# EAGLE design fully-monty (EAGLE 9.1.1)
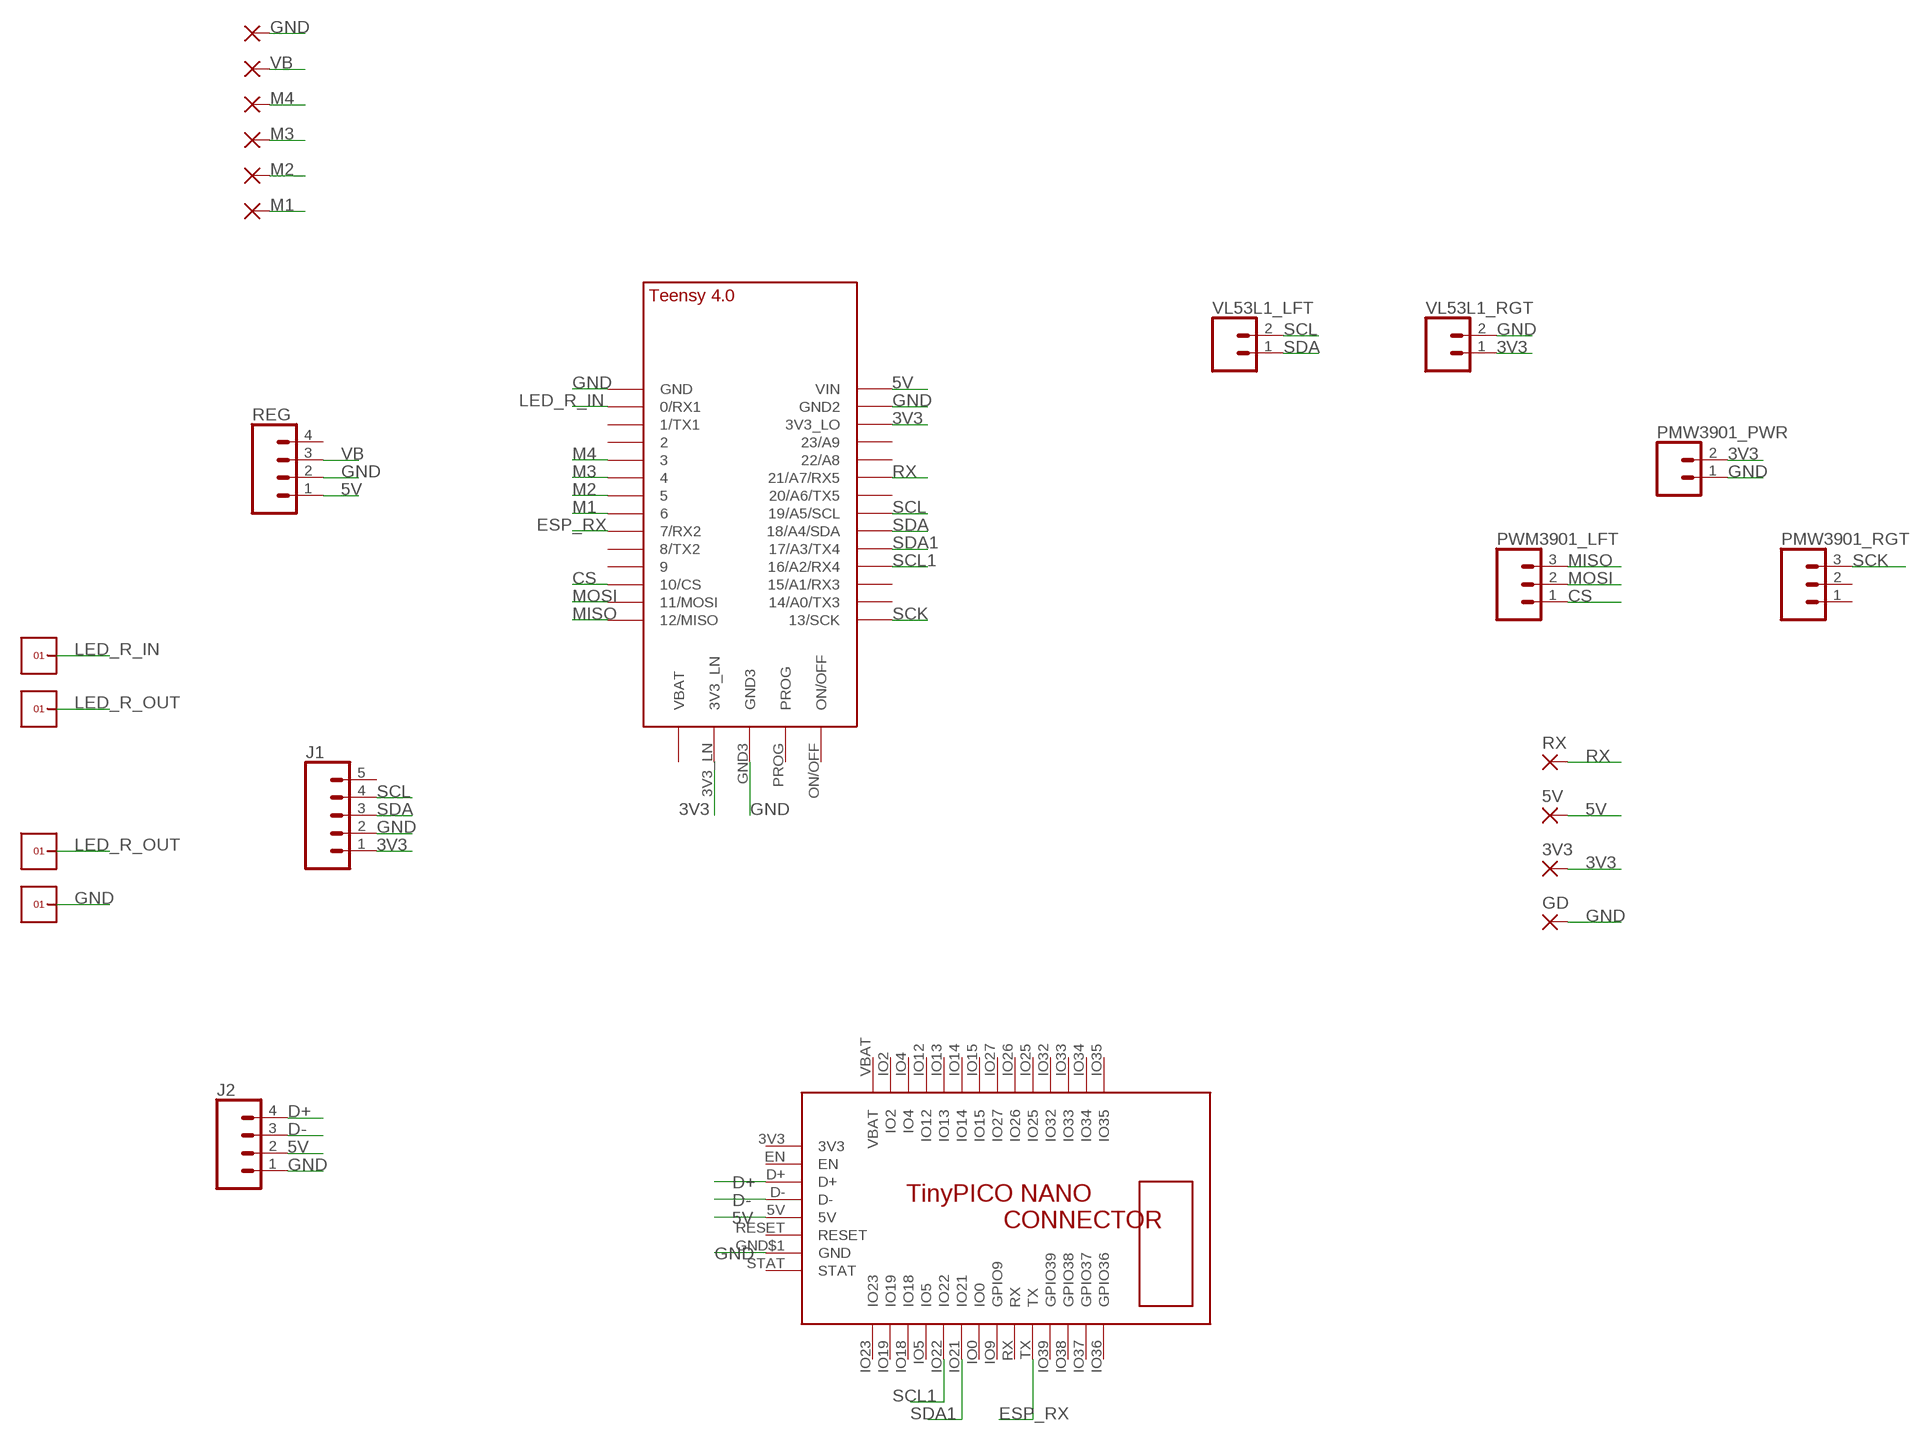
[diagram p0: schematic, sheet 1]

## Parts
3V3  SMD2  [SMD1,27-2,54]
5V  SMD2  [SMD1,27-2,54]
GD  SMD2  [SMD1,27-2,54]
GND  SMD2  [SMD1,27-2,54]
J1  CONN_05NO_SILK  [1X05_NO_SILK]
J2  CONN_041X04_NO_SILK  [1X04_NO_SILK]
M1  SMD2  [SMD1,27-2,54]
M2  SMD2  [SMD1,27-2,54]
M3  SMD2  [SMD1,27-2,54]
M4  SMD2  [SMD1,27-2,54]
PMW3901_PWR  CONN_021X02_NO_SILK  [1X02_NO_SILK]
PMW3901_RGT  CONN_031X03_NO_SILK  [1X03_NO_SILK]
PWM3901_LFT  CONN_031X03_NO_SILK  [1X03_NO_SILK]
REG  CONN_041X04_NO_SILK  [1X04_NO_SILK]
RX  SMD2  [SMD1,27-2,54]
U$1  TEENSY_4.0  [TEENSY_4.0]
U$2  TINYPICO-NANO-CONNECTOR  [TINYPICO-NANO-CONNECTOR]
U$3  1X1  [1X1]
U$4  1X1  [1X1]
U$6  1X1  [1X1]
U$7  1X1  [1X1]
VBAT  SMD2  [SMD1,27-2,54]
VL53L1_LFT  CONN_021X02_NO_SILK  [1X02_NO_SILK]
VL53L1_RGT  CONN_021X02_NO_SILK  [1X02_NO_SILK]

## Nets
3V3: 3V3.1(P) J1.1 PMW3901_PWR.2 U$1.3V3_LN U$1.3V3_LO VL53L1_RGT.1
5V: 5V.1(P) J2.2 REG.1 U$1.VIN U$2.5V
CS: PWM3901_LFT.1 U$1.10/CS
D+: J2.4 U$2.D+
D-: J2.3 U$2.D-
ESP_RX: U$1.7(7/RX2) U$2.TX
GND: GD.1(P) GND.1(P) J1.2 J2.1 PMW3901_PWR.1 REG.2 U$1.GND U$1.GND2 U$1.GND3 U$2.GND$1(GND) U$7.1 VL53L1_RGT.2
LED_R_IN: U$1.0/RX(0/RX1) U$3.1
LED_R_OUT: U$4.1 U$6.1
M1: M1.1(P) U$1.6
M2: M2.1(P) U$1.5
M3: M3.1(P) U$1.4/CANRX
M4: M4.1(P) U$1.3/CANTX
MISO: PWM3901_LFT.3 U$1.12/MISO
MOSI: PWM3901_LFT.2 U$1.11/MOSI
RX: RX.1(P) U$1.21/A7(21/A7/RX5)
SCK: PMW3901_RGT.3 U$1.13/SCK
SCL: J1.4 U$1.19/A5/SCL VL53L1_LFT.2
SCL1: U$1.16/A2(16/A2/RX4) U$2.IO22
SDA: J1.3 U$1.18/A4/SDA VL53L1_LFT.1
SDA1: U$1.17/A3(17/A3/TX4) U$2.IO21
VB: REG.3 VBAT.1(P)
Unconnected: J1.5 PMW3901_RGT.1 PMW3901_RGT.2 REG.4 U$1.1/TX(1/TX1) U$1.2 U$1.8(8/TX2) U$1.9/CS U$1.14/A0(14/A0/TX3) U$1.15/A1(15/A1/RX3) U$1.20/A6(20/A6/TX5) U$1.22/A8 U$1.23/A9 U$1.ON/OFF U$1.PROG U$1.VBAT\(VBAT) U$2.EN U$2.IO0 U$2.IO2 U$2.IO4 U$2.IO5 U$2.IO9(GPIO9) U$2.IO12 U$2.IO13 U$2.IO14 U$2.IO15 U$2.IO18 U$2.IO19 U$2.IO23 U$2.IO25 U$2.IO26 U$2.IO27 U$2.IO32 U$2.IO33 U$2.IO34 U$2.IO35 U$2.IO36(GPIO36) U$2.IO37(GPIO37) U$2.IO38(GPIO38) U$2.IO39(GPIO39) U$2.RESET U$2.RX U$2.STAT

## Power pins joined to a net without a drawn wire
3V3: U$2.3V3
VB: U$2.VBAT

## Library data of the parts
3V3 5V GD GND M1-M4 RX VBAT = wirepad:SMD2: SMD PAD
J1 = SparkFun-Connectors:CONN_05: Multi connection point. Often used as Generic Header-pin footprint for 0.1 inch spaced/style header connections On any of the 0.1 inch spaced packages, you can populate with these: Break Away Headers - Straight <https://www.sparkfun.com/products/116> (PRT-00116) Break Away Male Headers - Right Angle <https://www.sparkfun.com/products/553> (PRT-00553) Female Headers <https://www.sparkfun.com/products/115> (PRT-00115) Break Away Headers - Machine Pin <https://www.sparkfun.com/products/117> (PRT-00117) Break Away Female Headers - Swiss Machine Pin <https://www.sparkfun.com/products/743> (PRT-00743) For SCREWTERMINALS and SPRING TERMINALS visit here: Screw Terimnals on SparkFun.com <https://www.sparkfun.com/search/results?term=Screw+Terminals> (5mm/3.5mm/2.54mm spacing) This device is also useful as a general connection point to wire up your design to another part of your project. Our various solder wires solder well into these plated through hole pads. Hook-Up Wire - Assortment (Stranded, 22 AWG) <https://www.sparkfun.com/products/11375> (PRT-11375) Hook-Up Wire - Assortment (Solid Core, 22 AWG) <https://www.sparkfun.com/products/11367> (PRT-11367) View the entire wire category on our website here <https://www.sparkfun.com/categories/141> Special notes: Molex polarized connector foot print use with SKU : PRT-08231 with associated crimp pins and housings. 1MM SMD Version SKU: PRT-10208
J2 REG = SparkFun-Connectors:CONN_04: Multi connection point. Often used as Generic Header-pin footprint for 0.1 inch spaced/style header connections On any of the 0.1 inch spaced packages, you can populate with these: Break Away Headers - Straight <https://www.sparkfun.com/products/116> (PRT-00116) Break Away Male Headers - Right Angle <https://www.sparkfun.com/products/553> (PRT-00553) Female Headers <https://www.sparkfun.com/products/115> (PRT-00115) Break Away Headers - Machine Pin <https://www.sparkfun.com/products/117> (PRT-00117) Break Away Female Headers - Swiss Machine Pin <https://www.sparkfun.com/products/743> (PRT-00743) For SCREWTERMINALS and SPRING TERMINALS visit here: Screw Terimnals on SparkFun.com <https://www.sparkfun.com/search/results?term=Screw+Terminals> (5mm/3.5mm/2.54mm spacing) This device is also useful as a general connection point to wire up your design to another part of your project. Our various solder wires solder well into these plated through hole pads. Hook-Up Wire - Assortment (Stranded, 22 AWG) <https://www.sparkfun.com/products/11375> (PRT-11375) Hook-Up Wire - Assortment (Solid Core, 22 AWG) <https://www.sparkfun.com/products/11367> (PRT-11367) View the entire wire category on our website here <https://www.sparkfun.com/categories/141> Special notes: Molex polarized connector foot print use with SKU : PRT-08231 with associated crimp pins and housings. 1MM SMD Version SKU: PRT-10208; PROD_ID: CONN-09696
PMW3901_PWR VL53L1_LFT VL53L1_RGT = SparkFun-Connectors:CONN_02: Multi connection point. Often used as Generic Header-pin footprint for 0.1 inch spaced/style header connections On any of the 0.1 inch spaced packages, you can populate with these: Break Away Headers - Straight <https://www.sparkfun.com/products/116> (PRT-00116) Break Away Male Headers - Right Angle <https://www.sparkfun.com/products/553> (PRT-00553) Female Headers <https://www.sparkfun.com/products/115> (PRT-00115) Break Away Headers - Machine Pin <https://www.sparkfun.com/products/117> (PRT-00117) Break Away Female Headers - Swiss Machine Pin <https://www.sparkfun.com/products/743> (PRT-00743) For SCREWTERMINALS and SPRING TERMINALS visit here: Screw Terimnals on SparkFun.com <https://www.sparkfun.com/search/results?term=Screw+Terminals> (5mm/3.5mm/2.54mm spacing) This device is also useful as a general connection point to wire up your design to another part of your project. Our various solder wires solder well into these plated through hole pads. Hook-Up Wire - Assortment (Stranded, 22 AWG) <https://www.sparkfun.com/products/11375> (PRT-11375) Hook-Up Wire - Assortment (Solid Core, 22 AWG) <https://www.sparkfun.com/products/11367> (PRT-11367) View the entire wire category on our website here <https://www.sparkfun.com/categories/141> Special notes: Molex polarized connector foot print use with: PRT-08233 with associated crimp pins and housings. 2.54_SCREWTERM for use with PRT-10571. 3.5mm Screw Terminal footprints for PRT-08084 5mm Screw Terminal footprints for use with PRT-08432
PMW3901_RGT PWM3901_LFT = SparkFun-Connectors:CONN_03: Multi connection point. Often used as Generic Header-pin footprint for 0.1 inch spaced/style header connections On any of the 0.1 inch spaced packages, you can populate with these: Break Away Headers - Straight <https://www.sparkfun.com/products/116> (PRT-00116) Break Away Male Headers - Right Angle <https://www.sparkfun.com/products/553> (PRT-00553) Female Headers <https://www.sparkfun.com/products/115> (PRT-00115) Break Away Headers - Machine Pin <https://www.sparkfun.com/products/117> (PRT-00117) Break Away Female Headers - Swiss Machine Pin <https://www.sparkfun.com/products/743> (PRT-00743) Stackable Header - 3 Pin (Female, 0.1") <https://www.sparkfun.com/products/13875> (PRT-13875) For SCREWTERMINALS and SPRING TERMINALS visit here: Screw Terimnals on SparkFun.com <https://www.sparkfun.com/search/results?term=Screw+Terminals> (5mm/3.5mm/2.54mm spacing) This device is also useful as a general connection point to wire up your design to another part of your project. Our various solder wires solder well into these plated through hole pads. Hook-Up Wire - Assortment (Stranded, 22 AWG) <https://www.sparkfun.com/products/11375> (PRT-11375) Hook-Up Wire - Assortment (Solid Core, 22 AWG) <https://www.sparkfun.com/products/11367> (PRT-11367) View the entire wire category on our website here <https://www.sparkfun.com/categories/141> Special notes: Molex polarized connector foot print use with SKU : PRT-08232 with associated crimp pins and housings.
U$1 = TEENSY 4.0:TEENSY_4.0
U$2 = TinyPICO_NANO_Eagle:TINYPICO-NANO-CONNECTOR: TinyPICO NANO Footprint https://www.tinypico.com/tinypico-nano
U$3 U$4 U$6 U$7 = headers(2mm):1X1

## Board
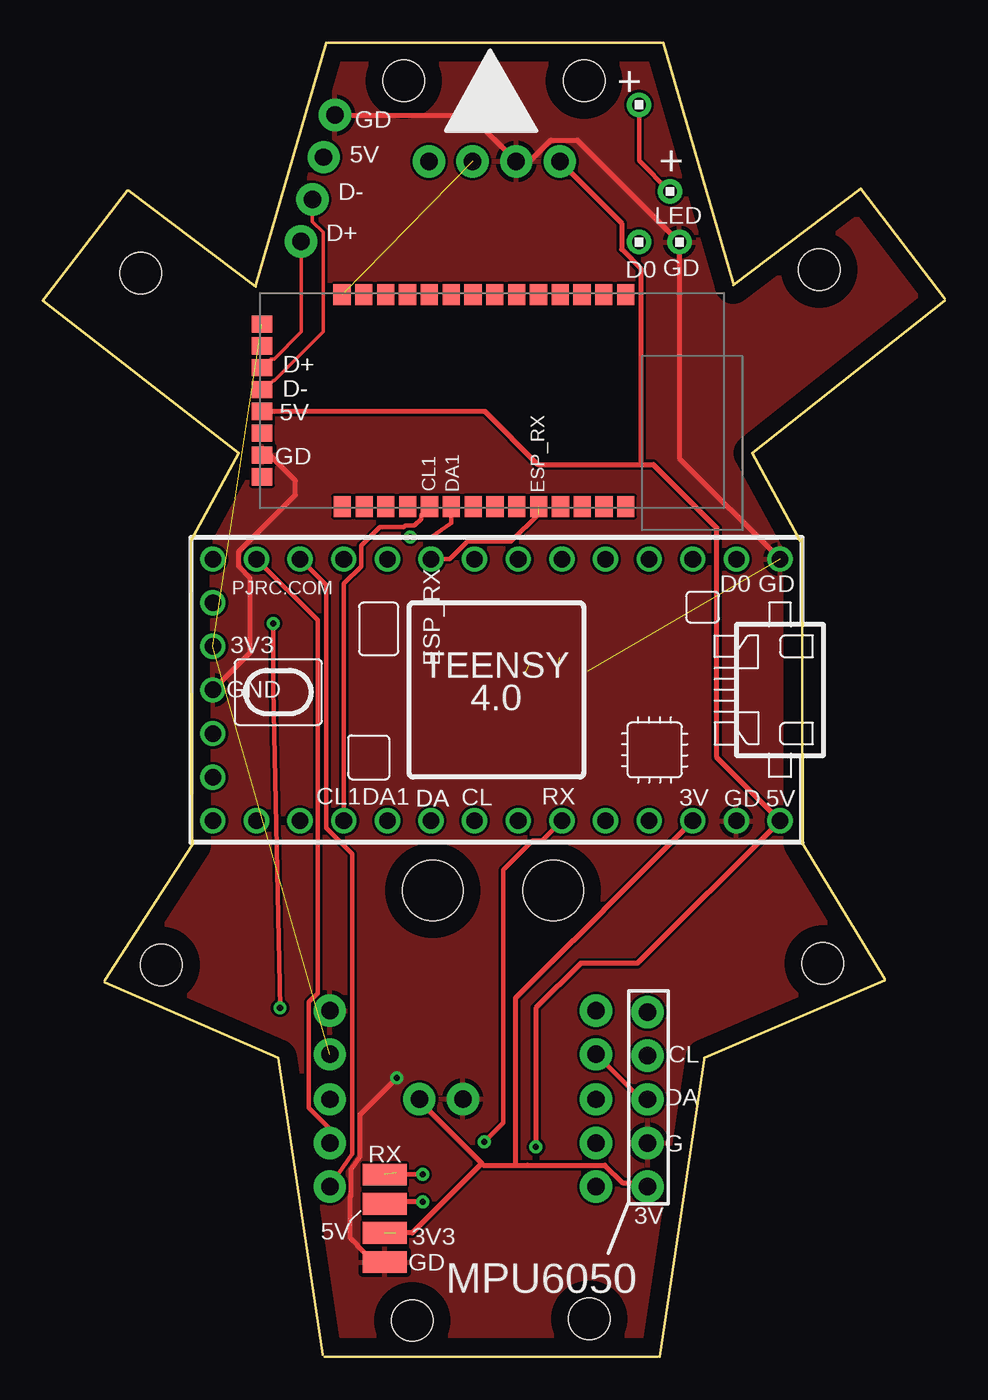
[diagram p1: board, top side]
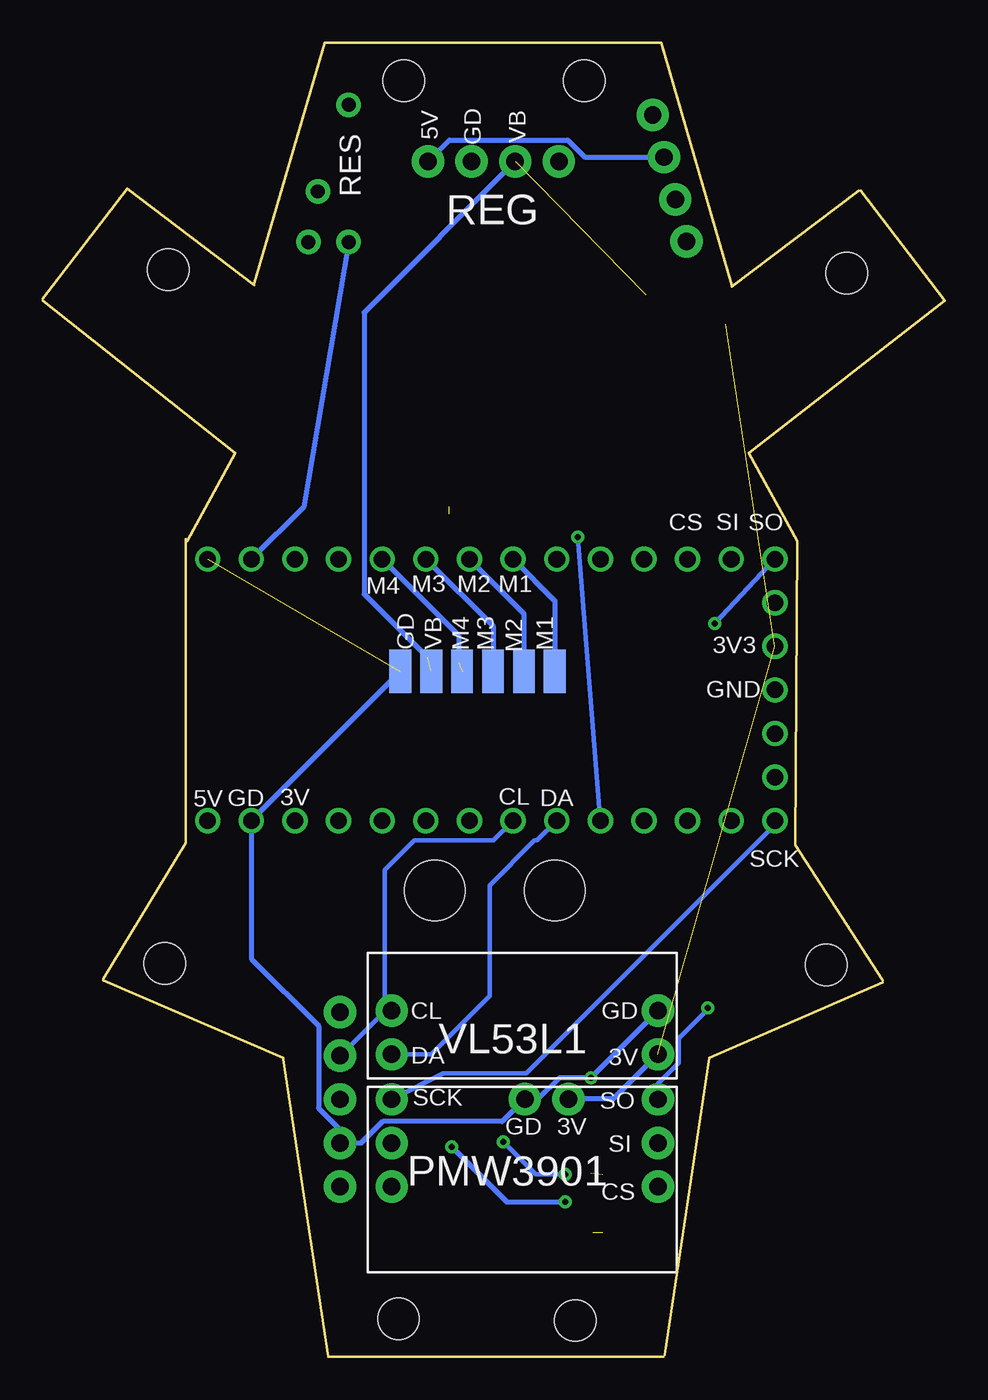
[diagram p2: board, bottom side, seen from below]

Size 52.5 x 76.5 mm. Coordinates in mm from the lower left corner, seen from the top.
Outline: 8.6,47.4 8.7,29.8 3.6,21.9
Outline: 44.2,47.6 44.2,29.9 49,22
Outline: 44.1,47.5 41.3,52.6 52.5,61.5
Outline: 52.5,61.6 47.6,68 40.2,62.4
Outline: 8.6,47.5 11.4,52.6 0,61.5 4.9,67.9
Outline: 5,67.9 12.4,62.3
Outline: 16.6,76.5 36,76.5
Outline: 40.2,62.5 36.1,76.5
Outline: 12.4,62.4 16.5,76.5
Outline: 16.4,0 35.8,0
Outline: 3.6,21.8 13.7,17.4 16.3,0.1
Outline: 38.5,17.3 35.9,0
Outline: 49,21.9 38.5,17.4
Copper layers (1*16): Top 0.035mm / dielectric 1.5mm / Bottom 0.035mm
Design rules "default": minimum track width 6mil, minimum drill 0.35mm, track to track 6mil, track to pad 6mil, pad to pad 6mil, via to via 6mil, smd to smd 6mil, copper to edge 40mil, drill to drill 6mil, minimum pad ring 10mil, minimum via ring 8mil, stop-mask expansion 4mil, vias tented up to drill 0mil, thermal gap 10mil
Holes 2.4 mm at 21,74.3 31.5,74.3 21.5,2.1 31.8,2.2 6.9,22.8 45.4,22.9 45.2,63.3 5.7,63.1
Holes 3.5 mm at 22.7,27.15 29.7,27.15

### Footprints (pad centres in the part's own frame; a part is rotated, then mirrored left to right if it is on the bottom)
SMD1,27-2,54 = smd 1.27 x 2.54: 1 0,0
1X05_NO_SILK = drill 1.016 pad 1.88: 1 0,0; 2 2.54,0; 3 5.08,0; 4 7.62,0; 5 10.16,0
1X04_NO_SILK = drill 1.016 pad 1.88: 1 0,0; 2 2.54,0; 3 5.08,0; 4 7.62,0
1X02_NO_SILK = drill 1.016 pad 1.88: 1 0,0; 2 2.54,0
1X03_NO_SILK = drill 1.016 pad 1.88: 1 0,0; 2 2.54,0; 3 5.08,0
TEENSY_4.0 = drill 0.965: 0/RX -13.97,-7.62; 1/TX -11.43,-7.62; 2 -8.89,-7.62; 3/CANTX -6.35,-7.62; 3V3_LN 16.51,-2.54; 3V3_LO -11.43,7.62; 4/CANRX -3.81,-7.62; 5 -1.27,-7.62; 6 1.27,-7.62; 7 3.81,-7.62; 8 6.35,-7.62; 9/CS 8.89,-7.62; 10/CS 11.43,-7.62; 11/MOSI 13.97,-7.62; 12/MISO 16.51,-7.62; 13/SCK 16.51,7.62; 14/A0 13.97,7.62; 15/A1 11.43,7.62; 16/A2 8.89,7.62; 17/A3 6.35,7.62; 18/A4/SDA 3.81,7.62; 19/A5/SCL 1.27,7.62; 20/A6 -1.27,7.62; 21/A7 -3.81,7.62; 22/A8 -6.35,7.62; 23/A9 -8.89,7.62; GND -16.51,-7.62; GND2 -13.97,7.62; GND3 16.51,0; ON/OFF 16.51,5.08; PROG 16.51,2.54; VBAT\ 16.51,-5.08; VIN -16.51,7.62
TINYPICO-NANO-CONNECTOR = smd 1.2 x 1: 3V3 0.1,10.725; 5V 0.1,5.645; D+ 0.1,8.185; D- 0.1,6.915; EN 0.1,9.455; GND$1 0.1,3.105; RESET 0.1,4.375; STAT 0.1,1.835 | smd 1 x 1.2: IO0 12.395,0.1; IO2 6.034,12.44; IO4 7.304,12.44; IO5 8.585,0.1; IO9 13.665,0.1; IO12 8.574,12.44; IO13 9.844,12.44; IO14 11.114,12.44; IO15 12.384,12.44; IO18 7.315,0.1; IO19 6.045,0.1; IO21 11.125,0.1; IO22 9.855,0.1; IO23 4.775,0.1; IO25 16.194,12.44; IO26 14.924,12.44; IO27 13.654,12.44; IO32 17.464,12.44; IO33 18.734,12.44; IO34 20.004,12.44; IO35 21.274,12.44; IO36 21.285,0.1; IO37 20.015,0.1; IO38 18.745,0.1; IO39 17.475,0.1; RX 14.935,0.1; TX 16.205,0.1; VBAT 4.764,12.44
1X1 = drill 0.8 pad 1.422: 1 0,0

### Placement (x,y rotation side)
3V3  19.9,7.2 90 top
5V  19.9,8.9 90 top
GD  19.9,5.5 90 top
GND  31.7,39.9 180 bottom
J1  35.2,9.9 90 top
J2  17,72.3 255 top
M1  22.7,39.9 0 bottom
M2  24.5,39.9 180 bottom
M3  26.3,39.9 0 bottom
M4  28.1,39.9 180 bottom
PMW3901_PWR  24.45,15 180 top
PMW3901_RGT  32.2,9.9 90 top
PWM3901_LFT  16.7,9.9 90 top
REG  30.09,69.6 180 top
RX  19.9,10.6 90 top
U$1  26.4,38.82 180 top
U$2  12.65,49.4 0 top
U$3  34.7,64.9 0 top
U$4  34.7,72.9 0 top
U$6  36.5,67.85 0 top
U$7  37.05,64.9 0 top
VBAT  29.9,39.9 180 bottom
VL53L1_LFT  32.2,17.6 90 top
VL53L1_RGT  16.7,17.6 90 top

### Tracks (layer width: path | path; a pad name or v marks a point on that pad's centre or on a via)
3V3  (3 unrouted)
  Top 0.305: J1.1 35.39,10.12 33.74,10.12 32.72,11.14 28.2,11.14 27.5,11.14 | 25.54,11.25 21.91,14.88 PMW3901_PWR.2 | 25.54,11.25 25.64,11.14 27.5,11.14 | 25.54,11.25 21.5,7.2 20.5,7.2 | 27.5,11.14 27.5,20.87 30.86,24.23 30.91,24.23 32.62,25.94 32.62,25.99 U$1.3V3_LO
  Bottom 0.305: VL53L1_RGT.1 19.3,15 PMW3901_PWR.2
5V  (via drill 0.35)
  Top 0.305: 12.5,55.05 U$2.5V 25.72,55.05 28.81,51.95 34.8,51.95 | 34.8,51.95 35.53,51.95 39.23,48.25 39.23,34.88 39.3,34.8 | 39.3,34.8 U$1.VIN 34.61,22.9 31.3,22.9 28.7,20.3 v28.7,12.2 | 39.3,34.8 | REG.1 33.68,66 33.68,64.48 34.8,63.36 34.8,51.95 | v22.1,9 20,9 5V.1
  Bottom 0.305: J2.2 20.95,69.85 21.95,70.84 28.84,70.84 REG.1 | v28.7,12.2 25.5,9 v22.1,9
CS
  Top 0.254: U$1.10/CS 16.49,44.92 16.49,30.78 18,29.27 18,15.1 | 18,15.1 18,15 | 18,15.1 | 18,15.1 18,11.8 PWM3901_LFT.1
D+
  Top 0.203: U$2.D+ 13.27,58.1 13.45,58.1 15.03,59.67 J2.4
D-
  Top 0.203: 12.9,56.31 13.42,56.83 13.45,56.83 16.31,59.68 16.31,65.47 15.68,66.09 J2.3
  Top 0.254: 13.02,56.31 12.9,56.31 U$2.D-
ESP_RX  (1 unrouted)
  Top 0.254: 28.86,49.07 27.24,47.46 24.71,47.46 23.69,46.44 U$1.7
GND  (via drill 0.35)  (1 unrouted)
  Top 0.305: U$1.GND3 12.05,40.98 12.05,45.35 11.39,46.01 11.39,46.87 14.7,50.18 14.7,51 13.2,52.5 U$2.GND$1 | J2.1 24.85,72.3 REG.2 28.33,69.6 29.57,70.84 31.11,70.84 U$7.1 37.05,52.3 U$1.GND | GD.1 19.26,5.5 18.32,6.44 18.32,6.47 17.9,6.9 17.9,9.34 17.95,9.38 17.95,10.91 18.46,11.66 18.46,14.11 v20.59,16.24
  Bottom 0.305: VL53L1_RGT.2 v20.59,16.24 | v20.59,16.24 22.43,16.24 23.67,15 PMW3901_PWR.1 25.76,13.69 32.72,13.69 33.96,12.44 J1.2 | GND.1 40.37,31.23 U$1.GND2 40.37,23.17 36.44,19.24 36.44,14.46 35.39,13.41 | 35.39,13.41 35.2,13.22 | J1.2 | J1.2 35.2,13.22 | 35.2,13.22 35.39,13.41 | v20.59,16.24
  pour Top: 59.95,80.16 59.95,-1.35 -8.5,-1.35 -8.5,80.16
LED_R_IN
  Bottom 0.305: U$3.1 37.33,49.48 U$1.0/RX
LED_R_OUT
  Top 0.254: U$4.1 34.7,69.65 U$6.1
M1
  Bottom 0.305: U$1.6 22.7,44.01 M1.1
M2
  Bottom 0.305: U$1.5 24.5,43.27 M2.1
M3
  Bottom 0.305: U$1.4/CANRX 26.3,42.53 M3.1
M4  (1 unrouted)
  Bottom 0.305: U$1.3/CANTX 28.3,41.99 28.3,40.4
MISO  (via drill 0.35)
  Top 0.254: v13.8,20.3 13.4,38.9 v13.4,42.7
  Bottom 0.254: PWM3901_LFT.3 16.7,15.88 15.48,17.09 15.48,18.52 13.7,20.3 v13.8,20.3 | v13.4,42.7 U$1.12/MISO
MOSI
  Top 0.254: U$1.11/MOSI 15.99,42.88 15.99,21.15 15.48,20.64 15.48,14.47 16.7,13.26 PWM3901_LFT.2
RX  (via drill 0.35)  (1 unrouted)
  Top 0.254: U$1.21/A7 29.05,30.04 28.5,30.04 26.81,28.35 26.81,13.61 v25.7,12.5 | v22.1,10.6 20.7,10.6 20.6,10.7
  Bottom 0.254: v25.7,12.5 23.8,10.6 v22.1,10.6
SCK
  Bottom 0.203: 9.89,31.49 9.89,31.4 U$1.13/SCK
  Bottom 0.254: 9.89,31.4 9.89,30.96 24.36,16.49 29.19,16.49 PMW3901_RGT.3
SCL
  Bottom 0.254: U$1.19/A5/SCL 26.29,30.04 30.9,30.04 32.6,28.34 32.6,20.54 VL53L1_LFT.2 32.58,20.14 J1.4
SCL1
  Top 0.254: 22.21,49.5 U$2.IO22 22.02,49.01 22.02,48.78 21.62,48.39 21.1,48.39 21.01,48.3 19.6,48.3 18.53,47.23 18.53,46.02 17.51,45 U$1.16/A2
SDA
  Top 0.254: J1.3 35,14.98 34.82,14.98 VL53L1_LFT.1
  Bottom 0.254: U$1.18/A4/SDA 23.75,30.04 23.9,30.04 26.5,27.44 26.5,21 29.9,17.6 VL53L1_LFT.1
SDA1  (via drill 0.35)
  Top 0.254: v21.38,47.73 22.6,47.73 23.75,48.54 23.75,49.48 U$2.IO21
  Bottom 0.254: U$1.17/A3 v21.38,47.73
VB  (2 unrouted)
  Bottom 0.305: REG.3 33.8,60.81 33.8,44.4 30.1,40.7 29.7,40.7

### Text on the board
tNames: + | GD | 5V | + | D- | LED | D+ | D0 | GD | D+ | D- | 5V | CL1 | DA1 | GD | ESP_RX | D0 | GD | 3V3 | ESP_RX | GND | CL1 | DA1 | DA | DA | CL | RX | 3V | 5V | GD | CL | DA | G | 3V | MPU6050
bNames: VB | GD | 5V | RES | REG | SO | SI | CS | M1 | M2 | M3 | M4 | M1 | M2 | M3 | M4 | VB | GD | 3V3 | GND | DA | CL | 3V | GD | 5V | SCK | GD | VL53L1 | CL | 3V | DA | SO | SCK | 3V | GD | SI | PMW3901 | CS